# EAGLE schematic Power Circuit (EAGLE 7.5.0)
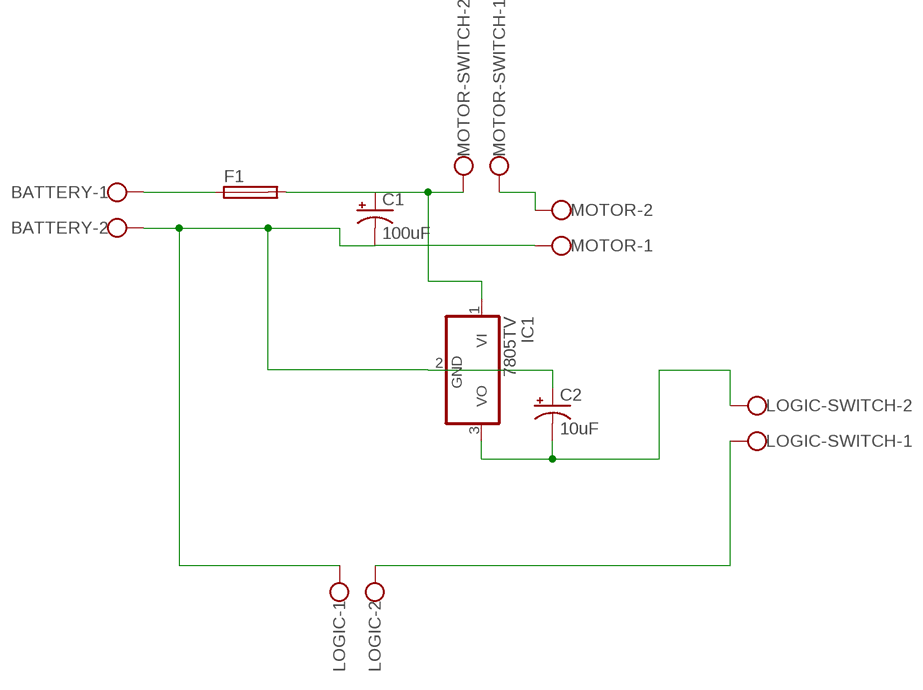
[diagram p0: schematic, sheet 1]

## Parts
BATTERY  W237-102  [W237-102]
C1  100uF  CPOL-USE2.5-5  [E2,5-5]
C2  10uF  CPOL-USE2.5-5  [E2,5-5]
F1  GSH15  [GSH15]
IC1  7805TV  [TO220V]
LOGIC  W237-102  [W237-102]
LOGIC-SWITCH  W237-102  [W237-102]
MOTOR  W237-102  [W237-102]
MOTOR-SWITCH  W237-102  [W237-102]

## Nets
N$1: BATTERY.1 F1.1
N$2: C1.+ F1.2 IC1.1(VI) MOTOR-SWITCH.2
N$4: MOTOR-SWITCH.1 MOTOR.2
N$5: BATTERY.2 C1.- C2.+ IC1.2(GND) MOTOR.1
N$6: LOGIC-SWITCH.1 LOGIC.2
N$7: LOGIC-SWITCH.2
N$8: C2.- IC1.3(VO)
Unconnected: LOGIC.1

## Library data of the parts
BATTERY LOGIC LOGIC-SWITCH MOTOR MOTOR-SWITCH = con-wago-500:W237-102: WAGO SCREW CLAMP; MPN: 237-102; OC_FARNELL: unknown; OC_NEWARK: 70K9898
C1 C2 = rcl:CPOL-US: POLARIZED CAPACITOR, American symbol
F1 = fuse:GSH15: FUSE HOLDER grid 15mm, 19649 Wickmann; MPN: 64900001039; OC_FARNELL: 1271673; OC_NEWARK: 02P0318
IC1 = linear:78*: Positive VOLTAGE REGULATOR Source: http://cache.national.com/ds/LM/LM78L05.pdf http://www.fairchildsemi.com/ds/LM/LM7805.pdf